# Altium schematic sheet Motor_Ctl.SchDoc: Stepper Motors Control
size A4; Author: Eladio Delgado Mingorance; CompanyName: bq - Mundo Reader; Organization: bq - Mundo Reader; Revision: 1.4; SheetNumber: 6; SheetTotal: 10
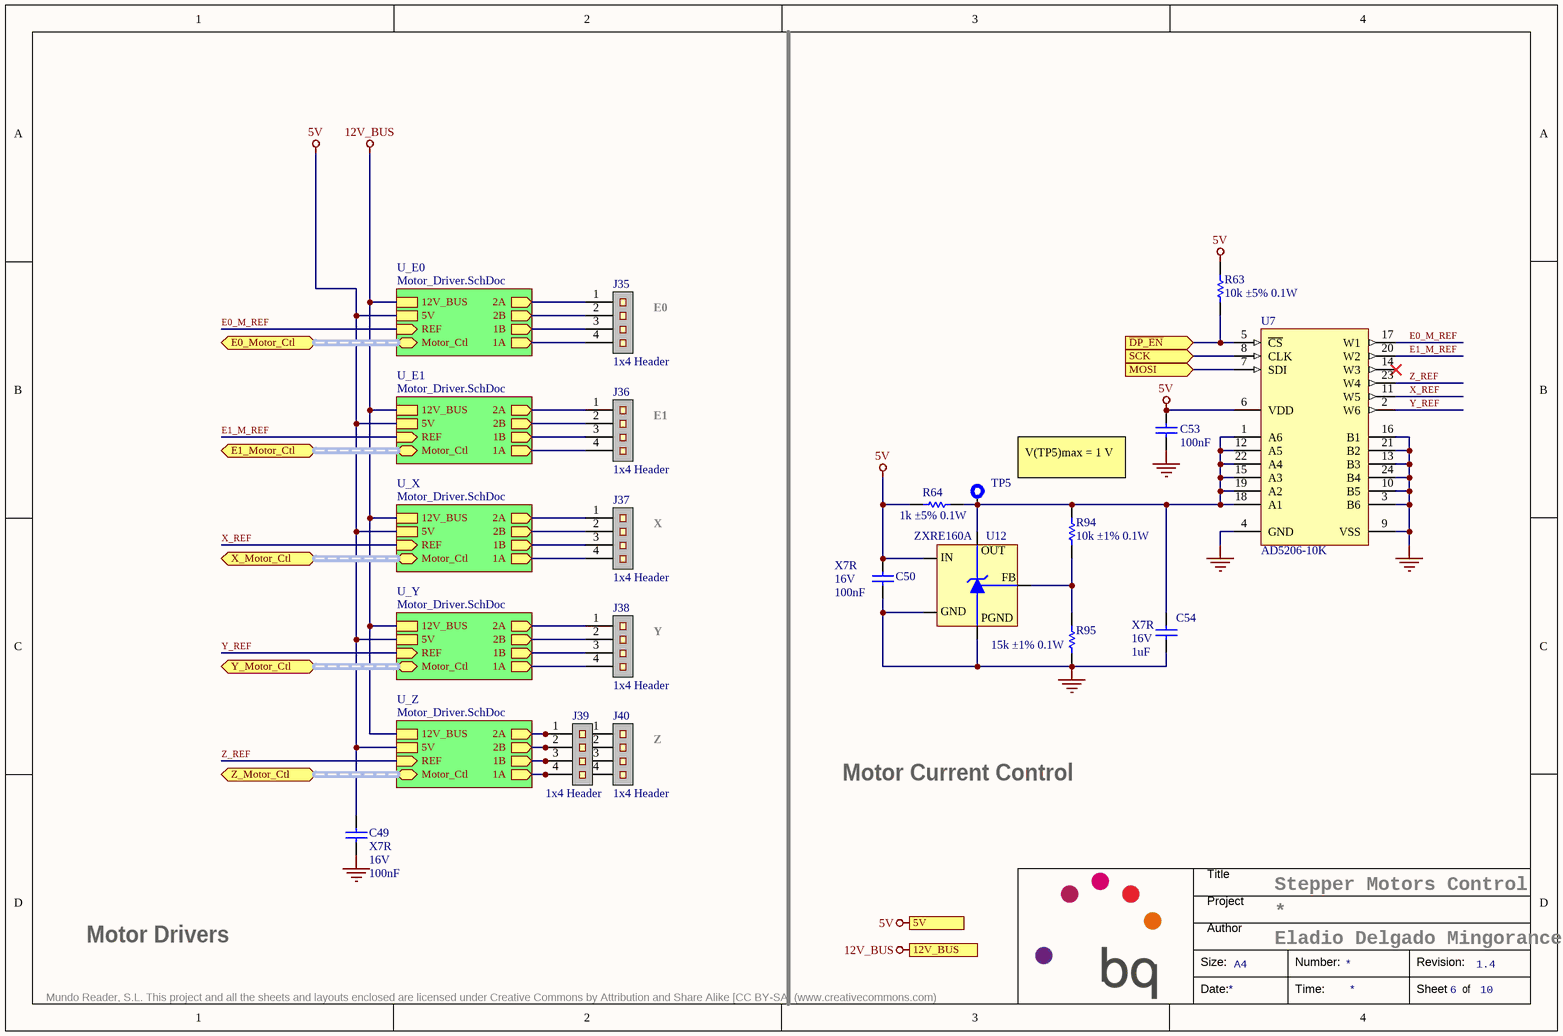
[diagram p0: Motor_Ctl.SchDoc]

## Parts
C49  Dielectric: X7R  Voltage: 16V  Capacitance: 100nF  [C0603]  (hidden comment: Capacitor)
C50  Dielectric: X7R  Voltage: 16V  Capacitance: 100nF  [C0603]  (hidden comment: Capacitor)
C53  Capacitance: 100nF  [C0603]  (hidden comment: Capacitor)
C54  Dielectric: X7R  Voltage: 16V  Capacitance: 1uF  [C0603]  (hidden comment: Capacitor)
J35  1x4 Header  [1x4 MTE Straight Header 2.54mm]
J36  1x4 Header  [1x4 MTE Straight Header 2.54mm]
J37  1x4 Header  [1x4 MTE Straight Header 2.54mm]
J38  1x4 Header  [1x4 MTE Straight Header 2.54mm]
J39  1x4 Header  [1x4 MTE Straight Header 2.54mm]
J40  1x4 Header  [1x4 MTE Straight Header 2.54mm]
R63  value 10k ±5% 0.1W  [R0603]  (hidden comment: Resistor)
R64  value 1k ±5% 0.1W  [R0603]  (hidden comment: Resistor)
R94  value 10k ±1% 0.1W  [R0603]  (hidden comment: Resistor)
R95  value 15k ±1% 0.1W  [R0603]  (hidden comment: Resistor)
TP5  Testpoint  [TP_SMD_1mm]  (value not drawn)  (no BOM)
U7  AD5206-10K  [TSSOP24_065]
U12  ZXRE160A  [SOT-353]

## Sub-sheets
U_E0 = Motor_Driver.SchDoc: 1A (out), 1B (out), 2B (out), 2A (out), Motor_Ctl (harness Motor_Ctl), 12V_BUS, 5V, REF (in)
U_E1 = Motor_Driver.SchDoc: 1A (out), 1B (out), 2B (out), 2A (out), Motor_Ctl (harness Motor_Ctl), 12V_BUS, 5V, REF (in)
U_X = Motor_Driver.SchDoc: 1A (out), 1B (out), 2B (out), 2A (out), Motor_Ctl (harness Motor_Ctl), 12V_BUS, 5V, REF (in)
U_Y = Motor_Driver.SchDoc: 1A (out), 1B (out), 2B (out), 2A (out), Motor_Ctl (harness Motor_Ctl), 12V_BUS, 5V, REF (in)
U_Z = Motor_Driver.SchDoc: 1A (out), 1B (out), 2B (out), 2A (out), Motor_Ctl (harness Motor_Ctl), 12V_BUS, 5V, REF (in)

## Ports
5V, 12V_BUS, E0_Motor_Ctl (harness Motor_Ctl), E1_Motor_Ctl (harness Motor_Ctl), MOSI (in), SCK (in), X_Motor_Ctl (harness Motor_Ctl), Y_Motor_Ctl (harness Motor_Ctl), Z_Motor_Ctl (harness Motor_Ctl), ~{DP_EN} (in)

## Nets
5V: C49.2 C50.2 C53.2 R63.1 R64.2 U7.6(VDD) U12.3 ; port 5V, sheet U_E0/5V, sheet U_E1/5V, sheet U_X/5V, sheet U_Y/5V, sheet U_Z/5V
12V_BUS: port 12V_BUS, sheet U_E0/12V_BUS, sheet U_E1/12V_BUS, sheet U_X/12V_BUS, sheet U_Y/12V_BUS, sheet U_Z/12V_BUS
GND: C49.1 C50.1 C53.1 C54.1 R95.1 U7.3(B6) U7.4(GND) U7.9(VSS) U7.10(B5) U7.13(B3) U7.16(B1) U7.21(B2) U7.24(B4) U12.1 U12.2
~{DP_EN}: R63.2 U7.5(~{CS}) ; port ~{DP_EN}
E0_M_REF: U7.17(W1) ; sheet U_E0/REF
E1_M_REF: U7.20(W2) ; sheet U_E1/REF
MOSI: U7.7(SDI) ; port MOSI
SCK: U7.8(CLK) ; port SCK
X_REF: U7.11(W5) ; sheet U_X/REF
Y_REF: U7.2(W6) ; sheet U_Y/REF
Z_REF: U7.23(W4) ; sheet U_Z/REF
NetC54_2: C54.2 R64.1 R94.2 TP5.1 U7.1(A6) U7.12(A5) U7.15(A3) U7.18(A1) U7.19(A2) U7.22(A4) U12.5
NetJ35_1: J35.1 ; sheet U_E0/2A
NetJ35_2: J35.2 ; sheet U_E0/2B
NetJ35_3: J35.3 ; sheet U_E0/1B
NetJ35_4: J35.4 ; sheet U_E0/1A
NetJ36_1: J36.1 ; sheet U_E1/2A
NetJ36_2: J36.2 ; sheet U_E1/2B
NetJ36_3: J36.3 ; sheet U_E1/1B
NetJ36_4: J36.4 ; sheet U_E1/1A
NetJ37_1: J37.1 ; sheet U_X/2A
NetJ37_2: J37.2 ; sheet U_X/2B
NetJ37_3: J37.3 ; sheet U_X/1B
NetJ37_4: J37.4 ; sheet U_X/1A
NetJ38_1: J38.1 ; sheet U_Y/2A
NetJ38_2: J38.2 ; sheet U_Y/2B
NetJ38_3: J38.3 ; sheet U_Y/1B
NetJ38_4: J38.4 ; sheet U_Y/1A
NetJ39_1: J39.1 J40.1 ; sheet U_Z/2A
NetJ39_2: J39.2 J40.2 ; sheet U_Z/2B
NetJ39_3: J39.3 J40.3 ; sheet U_Z/1B
NetJ39_4: J39.4 J40.4 ; sheet U_Z/1A
NetR94_1: R94.1 R95.2 U12.4

Not connected (* = marked no-connect by the designer): U7 14(W3)*

## Buses and harness runs
harness port E0_Motor_Ctl = sheet U_E0/Motor_Ctl
harness port E1_Motor_Ctl = sheet U_E1/Motor_Ctl
harness port X_Motor_Ctl = sheet U_X/Motor_Ctl
harness port Y_Motor_Ctl = sheet U_Y/Motor_Ctl
harness port Z_Motor_Ctl = sheet U_Z/Motor_Ctl

## Notes on the sheet
- (near J35) E0
- (near J36) E1
- V(TP5)max = 1 V
- (near J37) X
- (near J38) Y
- (near J40) Z
- Motor Current Control
- Motor Drivers
- Title
- Project
- Size:
- Author
- A4
- Number:
- Revision:
- Mundo Reader, S.L. This project and all the sheets and layouts enclosed are licensed under Creative Commons by Attribution and Share Alike [CC BY-SA] (www.creativecommons.com)
- Date:
- Time:
- Sheet
- of
- (in symbol ZXRE160A) OUT; IN; FB; GND; PGND

## Library data of the parts
C49 C50 = C0603_100nF_16V_±10%: Capacitor SMD; Manufacturer: Kemet; Value: 100nF ±10% 16V; Tolerance: ±10%; OrderingCode: C0603C104K4RAC; Temp_ Max: 125; Temp_ Min: -55; Part Number: C0603_100nF_16V_±10%; Price (€): 0,012
C53 = C0603_100nF_16V_±10%: Manufacturer: Kemet; Value: 100nF ±10% 16V; Dielectric: X7R; Voltage: 16V; Tolerance: ±10%; OrderingCode: C0603C104K4RAC; Temp_ Max: 125; Temp_ Min: -55; Part Number: C0603_100nF_16V_±10%; Price (€): 0,012
C54 = C0603_1uF_16V_±10%_X7R: Manufacturer: TDK; Value: 1uF ±10% 16V; Tolerance: ±10%; OrderingCode: C1608X7R1C105K080AC; Temp_ Max: 125; Temp_ Min: -55; OrderingCode 2: C0603C105K4RACTU; Part Number: C0603_1uF_16V_±10%_X7R; Price (€): 0,018; Manufacturer 2: Kemet
J35-J40 = CON_MTE_HDR_THT2.54_4: Connector, 1x4 MTE Straight Header 2.54mm; Manufacturer: TE Connectivity; OrderingCode: 5-104362-3; Temp_ Max: 105; Temp_ Min: -65; Value: 4; Part Number: CON_MTE_HDR_THT2.54_4; Price (€): 0,466; Supplier: Abacus
R63 = R0603_10k_0.1W_±5%: Manufacturer: Vishay; Tolerance: ±5%; OrderingCode: CRCW060310K0JN; Power: 0.1W; Resistance: 10k; Temp_ Max: 155; Temp_ Min: -55; PackageDescription: SMD; Part Number: R0603_10k_0.1W_±5%; Price (€): 0,003
R64 = R0603_1k_0.1W_±5%: Resistor, SMD; Manufacturer: Vishay; Tolerance: ±5%; OrderingCode: CRCW06031K00JN; Power: 0.1W; Resistance: 1k; Temp_ Max: 155; Temp_ Min: -55; PackageDescription: SMD; Part Number: R0603_1k_0.1W_±5%; Price (€): 0,003
R94 = R0603_10k_0.1W_±1%: Resistor, SMD; Manufacturer: Vishay; Tolerance: ±1%; OrderingCode: CRCW060310K0FK; Power: 0.1W; Resistance: 10k; Temp_ Max: 155; Temp_ Min: -55; PackageDescription: SMD; Part Number: R0603_10k_0.1W_±1%; Price (€): 0,014
R95 = R0603_15k_0.1W_±1%: Resistor, SMD; Manufacturer: Vishay; Tolerance: ±1%; OrderingCode: CRCW060315K0FK; Power: 0.1W; Resistance: 15k; Temp_ Max: 155; Temp_ Min: -55; PackageDescription: SMD; Part Number: R0603_15k_0.1W_±1%; Price (€): 0,014
TP5 = TP_SMD_1mm: SAP: 303552; Part Number: TP_SMD_1mm
U7 = AD5206: 6-Channel Digital Potentiometer, 10K; Part Number: AD5206; Manufacturer: Analog Devices; Temp_ Max: 85; Temp_ Min: -40; OrderingCode: AD5206BRUZ10; Supplier: Silica; Price (€): 1,95
U12 = ZXRE160A: Adjustable Shunt Voltage Regulator; Manufacturer: Diodes Incorporated; Breakdown Voltage: 0,6; Tolerance: 0,005; Temp Coeff: 120ppm; OrderingCode: ZXRE160AH5TA; Temp_ Max: 125; Temp_ Min: -40; OrderingCode 2: ZXRE160H5TA; Part Number: ZXRE160A; Price (€): 0,34; Manufacturer 2: Diodes Incorporated